# EAGLE schematic MODBOT01 (EAGLE 9.5.2)
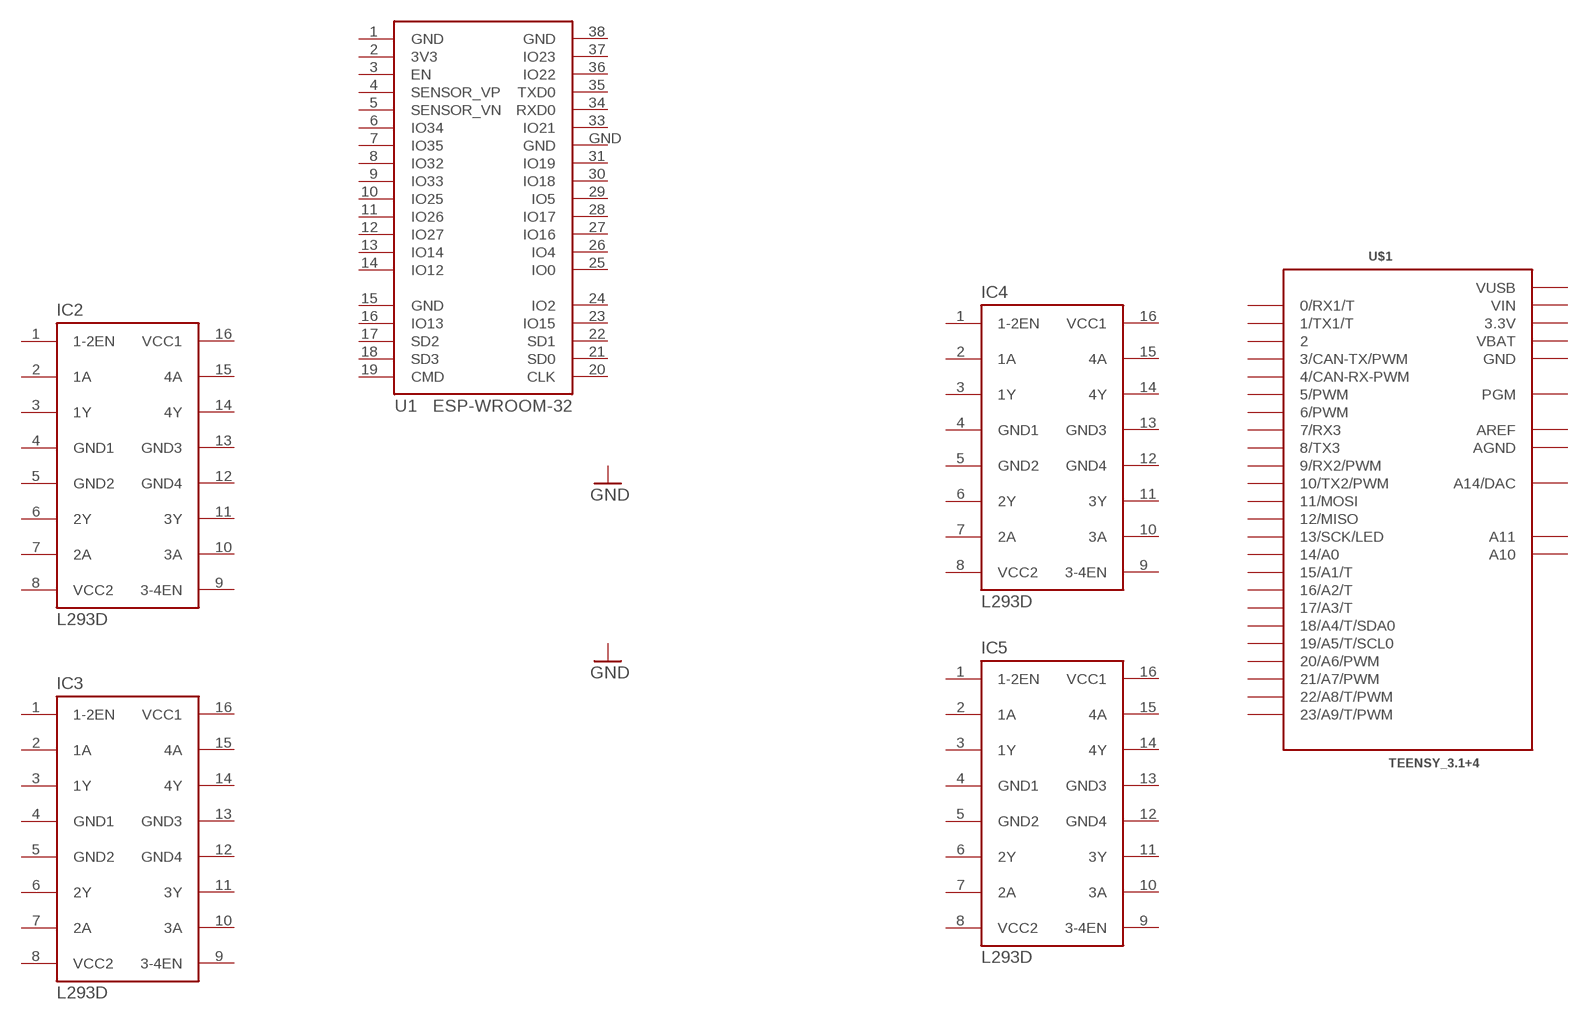
[diagram p0: schematic, sheet 1]

## Parts
IC2  L293D  [DIL16]
IC3  L293D  [DIL16]
IC4  L293D  [DIL16]
IC5  L293D  [DIL16]
U1  ESP-WROOM-32  [ESP-WROOM-32]
U$1  TEENSY_3.1+4  [TEENSY_3.1+4]
Unconnected: IC2.1(1-2EN) IC2.2(1A) IC2.3(1Y) IC2.6(2Y) IC2.7(2A) IC2.9(3-4EN) IC2.10(3A) IC2.11(3Y) IC2.14(4Y) IC2.15(4A) IC3.1(1-2EN) IC3.2(1A) IC3.3(1Y) IC3.6(2Y) IC3.7(2A) IC3.9(3-4EN) IC3.10(3A) IC3.11(3Y) IC3.14(4Y) IC3.15(4A) IC4.1(1-2EN) IC4.2(1A) IC4.3(1Y) IC4.6(2Y) IC4.7(2A) IC4.9(3-4EN) IC4.10(3A) IC4.11(3Y) IC4.14(4Y) IC4.15(4A) IC5.1(1-2EN) IC5.2(1A) IC5.3(1Y) IC5.6(2Y) IC5.7(2A) IC5.9(3-4EN) IC5.10(3A) IC5.11(3Y) IC5.14(4Y) IC5.15(4A) U1.3(EN) U1.4(SENSOR_VP) U1.5(SENSOR_VN) U1.6(IO34) U1.7(IO35) U1.8(IO32) U1.9(IO33) U1.10(IO25) U1.11(IO26) U1.12(IO27) U1.13(IO14) U1.14(IO12) U1.16(IO13) U1.17(SD2) U1.18(SD3) U1.19(CMD) U1.20(CLK) U1.21(SD0) U1.22(SD1) U1.23(IO15) U1.24(IO2) U1.25(IO0) U1.26(IO4) U1.27(IO16) U1.28(IO17) U1.29(IO5) U1.30(IO18) U1.31(IO19) U1.33(IO21) U1.34(RXD0) U1.35(TXD0) U1.36(IO22) U1.37(IO23) U$1.0(0/RX1/T) U$1.1(1/TX1/T) U$1.2 U$1.3(3/CAN-TX/PWM) U$1.4(4/CAN-RX-PWM) U$1.5(5/PWM) U$1.6(6/PWM) U$1.7(7/RX3) U$1.8(8/TX3) U$1.9(9/RX2/PWM) U$1.10(10/TX2/PWM) U$1.11(11/MOSI) U$1.12(12/MISO) U$1.13(13/SCK/LED) U$1.14/A0 U$1.15/A1(15/A1/T) U$1.16/A2(16/A2/T) U$1.17/A3(17/A3/T) U$1.18/A4(18/A4/T/SDA0) U$1.19/A5(19/A5/T/SCL0) U$1.20/A6(20/A6/PWM) U$1.21/A7(21/A7/PWM) U$1.22/A8(22/A8/T/PWM) U$1.23/A9(23/A9/T/PWM) U$1.A10 U$1.A11 U$1.A14(A14/DAC) U$1.PGM

## Power pins joined to a net without a drawn wire
3.3V: U$1.3.3V U$1.3.3V1(3.3V)
3V3: U1.2(3V3)
AGND: U$1.AGND
AREF: U$1.AREF
GND: U1.1(GND) U1.15(GND) U1.38(GND) U1.GND U$1.GND U$1.GND1(GND)
GND1: IC2.4(GND1) IC3.4(GND1) IC4.4(GND1) IC5.4(GND1)
GND2: IC2.5(GND2) IC3.5(GND2) IC4.5(GND2) IC5.5(GND2)
GND3: IC2.13(GND3) IC3.13(GND3) IC4.13(GND3) IC5.13(GND3)
GND4: IC2.12(GND4) IC3.12(GND4) IC4.12(GND4) IC5.12(GND4)
VBAT: U$1.VBAT
VCC1: IC2.16(VCC1) IC3.16(VCC1) IC4.16(VCC1) IC5.16(VCC1)
VCC2: IC2.8(VCC2) IC3.8(VCC2) IC4.8(VCC2) IC5.8(VCC2)
VIN: U$1.VIN
VUSB: U$1.VUSB

## Library data of the parts
IC2-IC5 = st-microelectronics:L293D: PUSH-PULL 4 CHANNEL DRIVER; MPN: L293D; OC_FARNELL: 9589619; OC_NEWARK: 56P8249
U1 = esp32:ESP-WROOM-32: Espressif Systems ESP-WROOM-32
U$1 = Teensy_3_Series_Board_v1.0:TEENSY_3.1+4: Footprint for Teensy 3.1 board using all through-holes, i.e. the entire perimeter plus the 4 through-holes inboard (A10,A11,AREF, VUSB)